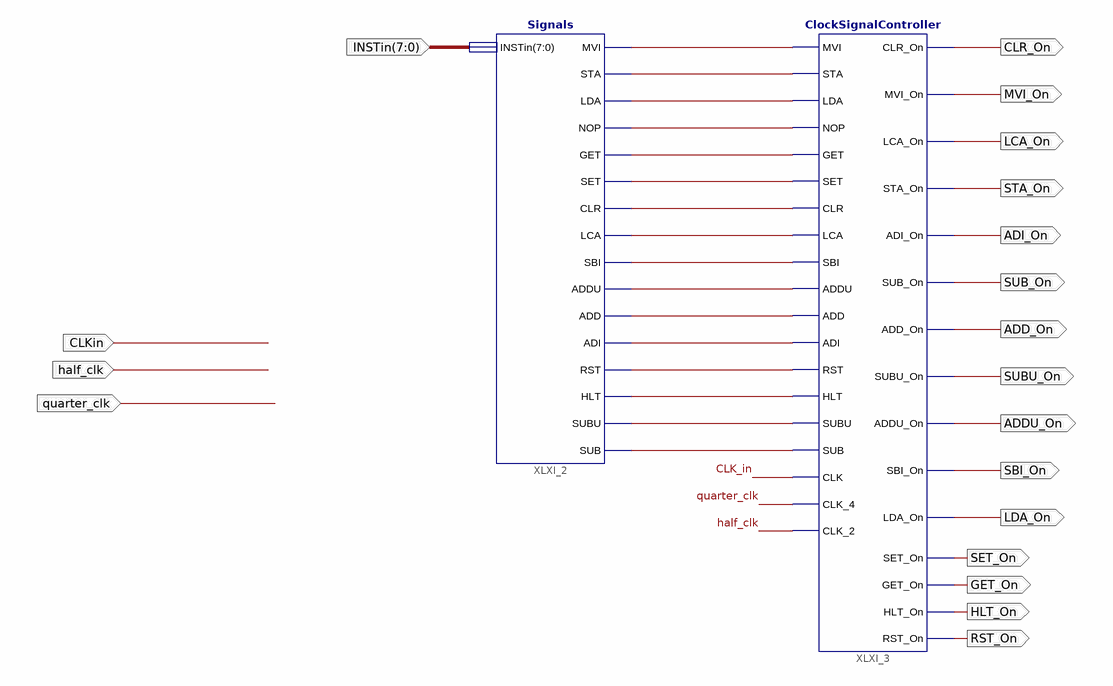
[diagram p0: schematic sheet 1]
// Xilinx ISE schematic InstructionControl.sch (spartan3e) as structural Verilog: 2 symbols, 19 ports
module InstructionControl (
  input  CLKin,
  input  quarter_clk,
  input  half_clk,
  input  [7:0] INSTin,
  output CLR_On,
  output MVI_On,
  output LCA_On,
  output STA_On,
  output ADI_On,
  output SUB_On,
  output ADD_On,
  output SUBU_On,
  output ADDU_On,
  output SBI_On,
  output LDA_On,
  output SET_On,
  output GET_On,
  output HLT_On,
  output RST_On
);

  wire CLK_in, XLXN_8, XLXN_9, XLXN_10, XLXN_11, XLXN_12, XLXN_13, XLXN_15, XLXN_16, XLXN_17, XLXN_18,
       XLXN_19, XLXN_20, XLXN_21, XLXN_22, XLXN_23, XLXN_24;

  Signals XLXI_2 (
    .INSTin(INSTin), .MVI(XLXN_9), .STA(XLXN_10), .LDA(XLXN_24), .NOP(XLXN_8), .GET(XLXN_11), .SET(XLXN_12),
    .CLR(XLXN_13), .LCA(XLXN_15), .SBI(XLXN_16), .ADDU(XLXN_17), .ADD(XLXN_18), .ADI(XLXN_19), .RST(XLXN_20),
    .HLT(XLXN_21), .SUBU(XLXN_22), .SUB(XLXN_23));
  ClockSignalController XLXI_3 (
    .MVI(XLXN_9), .STA(XLXN_10), .LDA(XLXN_24), .NOP(XLXN_8), .GET(XLXN_11), .SET(XLXN_12), .CLR(XLXN_13),
    .LCA(XLXN_15), .SBI(XLXN_16), .ADDU(XLXN_17), .ADD(XLXN_18), .ADI(XLXN_19), .RST(XLXN_20), .HLT(XLXN_21),
    .SUBU(XLXN_22), .SUB(XLXN_23), .CLK(CLK_in), .CLK_4(quarter_clk), .CLK_2(half_clk), .CLR_On(CLR_On),
    .MVI_On(MVI_On), .LCA_On(LCA_On), .STA_On(STA_On), .ADI_On(ADI_On), .SUB_On(SUB_On), .ADD_On(ADD_On),
    .SUBU_On(SUBU_On), .ADDU_On(ADDU_On), .SBI_On(SBI_On), .LDA_On(LDA_On), .SET_On(SET_On), .GET_On(GET_On),
    .HLT_On(HLT_On), .RST_On(RST_On));
endmodule
